# EAGLE design HB-UNI-SenAct-4-4-RC_V2.1 (EAGLE 9.3.1)
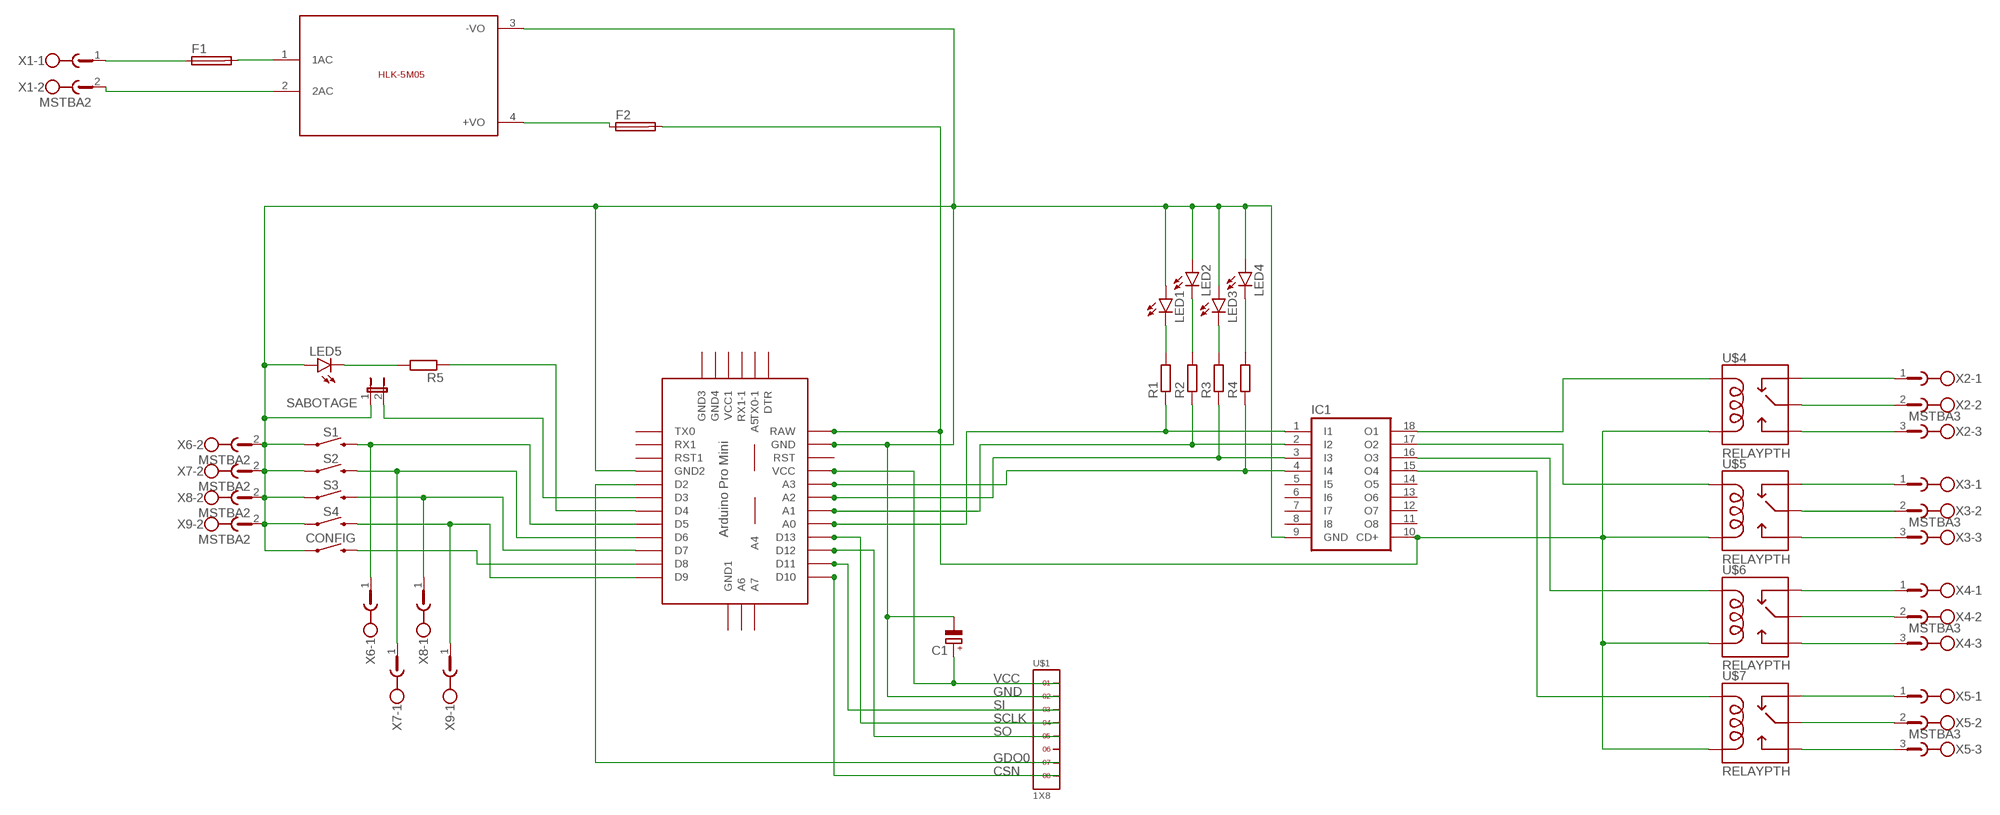
[diagram p0: schematic, sheet 1]

## Parts
C1  CPOL-EUE2.5-5  [E2,5-5]
CONFIG  MOMENTARY-SWITCH-SPST-PTH-6.0MM-KIT  [TACTILE_SWITCH_PTH_6.0MM_KIT]
F1  SH22,5A  [SH22,5A]
F2  SH22,5A  [SH22,5A]
IC1  ULN2803A  [DIL18]
LED1  LED3MM  [LED3MM]
LED2  LED3MM  [LED3MM]
LED3  LED3MM  [LED3MM]
LED4  LED3MM  [LED3MM]
LED5  LED3MM  [LED3MM]
R1  R-EU_0309/10  [0309/10]
R2  R-EU_0309/10  [0309/10]
R3  R-EU_0309/10  [0309/10]
R4  R-EU_0309/10  [0309/10]
R5  R-EU_0309/10  [0309/10]
S1  MOMENTARY-SWITCH-SPST-PTH-6.0MM  [TACTILE_SWITCH_PTH_6.0MM]
S2  MOMENTARY-SWITCH-SPST-PTH-6.0MM-KIT  [TACTILE_SWITCH_PTH_6.0MM_KIT]
S3  MOMENTARY-SWITCH-SPST-PTH-6.0MM-KIT  [TACTILE_SWITCH_PTH_6.0MM_KIT]
S4  MOMENTARY-SWITCH-SPST-PTH-6.0MM-KIT  [TACTILE_SWITCH_PTH_6.0MM_KIT]
SABOTAGE  JP1E  [JP1]
U$1  1X8  [1X8]
U$2  ABK-PRO-MINI  [ABK-PRO-MINI]
U$3  5VDC/5W  HLK-5M05  [HLK-5M05]
U$4  RELAYPTH  [SRD-05VDC-SL-C]
U$5  RELAYPTH  [SRD-05VDC-SL-C]
U$6  RELAYPTH  [SRD-05VDC-SL-C]
U$7  RELAYPTH  [SRD-05VDC-SL-C]
X1  MSTBA2  [MSTBA2]
X2  MSTBA3  [MSTBA3]
X3  MSTBA3  [MSTBA3]
X4  MSTBA3  [MSTBA3]
X5  MSTBA3  [MSTBA3]
X6  MSTBA2  [MSTBA2]
X7  MSTBA2  [MSTBA2]
X8  MSTBA2  [MSTBA2]
X9  MSTBA2  [MSTBA2]

## Nets
CSN: U$1.8 U$2.D10
GDO0: U$1.7 U$2.D2
GND: C1.- CONFIG.1 IC1.9(GND) LED1.A LED2.A LED3.A LED4.A LED5.A S1.1 S2.1 S3.1 S4.1 SABOTAGE.1 U$1.2 U$2.GND U$2.GND1(GND2) U$3.3(-VO) X6.2 X7.2 X8.2 X9.2
N$1: IC1.1(I1) R1.1 U$2.A0
N$2: IC1.2(I2) R2.1 U$2.A1
N$3: IC1.3(I3) R3.1 U$2.A2
N$4: IC1.4(I4) R4.1 U$2.A3
N$5: LED1.K(C) R1.2
N$6: LED2.K(C) R2.2
N$7: LED3.K(C) R3.2
N$8: LED4.K(C) R4.2
N$9: F1.1 X1.1
N$10: F2.1 U$3.4(+VO)
N$11: U$3.2(2AC) X1.2
N$12: S1.3 U$2.D5 X6.1
N$13: S2.3 U$2.D6 X7.1
N$14: S3.3 U$2.D7 X8.1
N$15: S4.3 U$2.D9 X9.1
N$16: CONFIG.3 U$2.D8
N$17: R5.1 U$2.D4
N$18: LED5.K(C) R5.2
N$19: F1.2 U$3.1(1AC)
N$20: SABOTAGE.2 U$2.D3
N$21: U$6.SWCLOSED(SWCLOSE) X4.1
N$22: U$7.SWCOMMON X5.2
N$23: U$6.SWOPEN X4.3
N$24: F2.2 IC1.10(CD+) U$2.RAW U$4.COIL0 U$5.COIL0 U$6.COIL0 U$7.COIL0
N$25: U$7.SWCLOSED(SWCLOSE) X5.1
N$26: U$6.SWCOMMON X4.2
N$27: U$7.SWOPEN X5.3
N$28: U$5.SWOPEN X3.3
N$29: U$5.SWCOMMON X3.2
N$30: U$5.SWCLOSED(SWCLOSE) X3.1
N$31: U$4.SWOPEN X2.3
N$32: U$4.SWCOMMON X2.2
N$33: U$4.SWCLOSED(SWCLOSE) X2.1
N$34: IC1.18(O1) U$4.COIL1
N$35: IC1.17(O2) U$5.COIL1
N$36: IC1.16(O3) U$6.COIL1
N$37: IC1.15(O4) U$7.COIL1
SCLK: U$1.4 U$2.D13
SI: U$1.3 U$2.D11
SO: U$1.5 U$2.D12
VCC: C1.+ U$1.1 U$2.VCC
Unconnected: IC1.5(I5) IC1.6(I6) IC1.7(I7) IC1.8(I8) IC1.11(O8) IC1.12(O7) IC1.13(O6) IC1.14(O5) U$1.6 U$2.A4 U$2.A5 U$2.A6 U$2.A7 U$2.DTR U$2.GND2(GND3) U$2.GND3(GND4) U$2.GND4(GND1) U$2.RST U$2.RST1 U$2.RX1 U$2.RX1-1 U$2.TX0 U$2.TX0-1 U$2.VCC1

## Library data of the parts
C1 = resistor:CPOL-EU: POLARIZED CAPACITOR, European symbol
CONFIG S1-S4 = SparkFun-Switches:MOMENTARY-SWITCH-SPST: Momentary Switch (Pushbutton) - SPST Normally-open (NO) SPST momentary switches (buttons, pushbuttons). Variants PTH-12MM - 12mm square, through-hole Momentary Pushbutton Switch - 12mm Square <https://www.sparkfun.com/products/9190> (COM-09190) PTH-6.0MM, PTH-6.0MM-KIT - 6.0mm square, through-hole Mini Pushbutton Switch <https://www.sparkfun.com/products/97> (COM-00097) KIT package intended for soldering kit's - only one side of pads' copper is exposed. PTH-RIGHT-ANGLE-KIT - Right-angle, through-hole Right Angle Tactile Button <https://www.sparkfun.com/products/10791> - Used on SparkFun BigTime Watch Kit <https://www.sparkfun.com/products/11734> SMD-12MM - 12mm square, surface-mount Tactile Button - SMD (12mm) <https://www.sparkfun.com/products/12993> (COM-12993) Used on SparkFun PicoBoard <https://www.sparkfun.com/products/11888> SMD-4.5MM - 4.5mm Square Trackball Switch Used on SparkFun Blackberry Trackballer Breakout <https://www.sparkfun.com/products/13169> SMD-4.6MMX2.8MM - 4.60mm x 2.80mm, surface mount Used on SparkFun SAMD21 Mini Breakout <https://www.sparkfun.com/products/13664> SMD-5.2MM, SMD-5.2-REDUNDANT - 5.2mm square, surface-mount Mini Pushbutton Switch - SMD <https://www.sparkfun.com/products/8720> (COM-08720) Used on Arduino Pro Mini <https://www.sparkfun.com/products/11114> REDUNDANT package connects both switch circuits together SMD-6.0X3.5MM - 6.0 x 3.5mm, surface mount Momentary Reset Switch SMD <https://www.sparkfun.com/products/8229> (COM-08229) SMD-6.2MM-TALL - 6.2mm square, surface mount Tactile Button - SMD (6mm) <https://www.sparkfun.com/products/12992> Used on SparkFun Digital Sandbox <https://www.sparkfun.com/products/12651> SMD-RIGHT-ANGLE - Right-angle, surface mount Used on SparkFun Block for Intel® Edison - Arduino <https://www.sparkfun.com/products/13036>; PROD_ID: SWCH-08441; SF_SKU: COM-00097
F1 F2 = fuse:SH22,5A: FUSE HOLDER grid 22,5mm, isolated cap OGN0031 8201, Schurter (Buerklin); MPN: 0031.7701.11; OC_FARNELL: unknown; OC_NEWARK: 04F1224
IC1 = uln-udn:ULN2803A: DRIVER ARRAY
LED1-LED5 = led:LED: LED OSRAM: - CHIPLED LG R971, LG N971, LY N971, LG Q971, LY Q971, LO R971, LY R971 LH N974, LH R974 LS Q976, LO Q976, LY Q976 LO Q996 - Hyper CHIPLED LW Q18S LB Q993, LB Q99A, LB R99A - SideLED LS A670, LO A670, LY A670, LG A670, LP A670 LB A673, LV A673, LT A673, LW A673 LH A674 LY A675 LS A676, LA A676, LO A676, LY A676, LW A676 LS A679, LY A679, LG A679 - Hyper Micro SIDELED® LS Y876, LA Y876, LO Y876, LY Y876 LT Y87S - SmartLED LW L88C, LW L88S LB L89C, LB L89S, LG L890 LS L89K, LO L89K, LY L89K LS L896, LA L896, LO L896, LY L896 - TOPLED LS T670, LO T670, LY T670, LG T670, LP T670 LSG T670, LSP T670, LSY T670, LOP T670, LYG T670 LG T671, LOG T671, LSG T671 LB T673, LV T673, LT T673, LW T673 LH T674 LS T676, LA T676, LO T676, LY T676, LB T676, LH T676, LSB T676, LW T676 LB T67C, LV T67C, LT T67C, LS T67K, LO T67K, LY T67K, LW E67C LS E67B, LA E67B, LO E67B, LY E67B, LB E67C, LV E67C, LT E67C LW T67C LS T679, LY T679, LG T679 LS T770, LO T770, LY T770, LG T770, LP T770 LB T773, LV T773, LT T773, LW T773 LH T774 LS E675, LA E675, LY E675, LS T675 LS T776, LA T776, LO T776, LY T776, LB T776 LHGB T686 LT T68C, LB T68C - Hyper Mini TOPLED® LB M676 - Mini TOPLED Santana® LG M470 LS M47K, LO M47K, LY M47K Source: http://www.osram.convergy.de LUXEON: - LUMILED® LXK2-PW12-R00, LXK2-PW12-S00, LXK2-PW14-U00, LXK2-PW14-V00 LXK2-PM12-R00, LXK2-PM12-S00, LXK2-PM14-U00 LXK2-PE12-Q00, LXK2-PE12-R00, LXK2-PE12-S00, LXK2-PE14-T00, LXK2-PE14-U00 LXK2-PB12-K00, LXK2-PB12-L00, LXK2-PB12-M00, LXK2-PB14-N00, LXK2-PB14-P00, LXK2-PB14-Q00 LXK2-PR12-L00, LXK2-PR12-M00, LXK2-PR14-Q00, LXK2-PR14-R00 LXK2-PD12-Q00, LXK2-PD12-R00, LXK2-PD12-S00 LXK2-PH12-R00, LXK2-PH12-S00 LXK2-PL12-P00, LXK2-PL12-Q00, LXK2-PL12-R00 Source: www.luxeon.com KINGBRIGHT: KA-3528ASYC Source: www.kingbright.com
R1-R5 = resistor:R-EU_: RESISTOR, European symbol
SABOTAGE = jumper:JP1E: JUMPER
U$1 = headers(2mm):1X8
U$2 = Arduino-clone:ABK-PRO-MINI: ABK Pro-Mini Arduino Clone
U$3 = HLK-5M05:HLK-5M05: HLK-5M05 is an 5Volt/5W smps developed by HI-LINK; SIZE: 23x38(mm)
U$4-U$7 = SRD-05VDC-SL-C:RELAY: SPDT relay (COM-00101)
X1 X6-X9 = con-phoenix-508:MSTBA2: PHOENIX; MF: FARNELL; MPN: 1757242; OC_FARNELL: 3705171; OC_NEWARK: 71C4161
X2-X5 = con-phoenix-508:MSTBA3: PHOENIX; MF: FARNELL; MPN: 1757255; OC_FARNELL: 3705183; OC_NEWARK: 71C4162

## Board
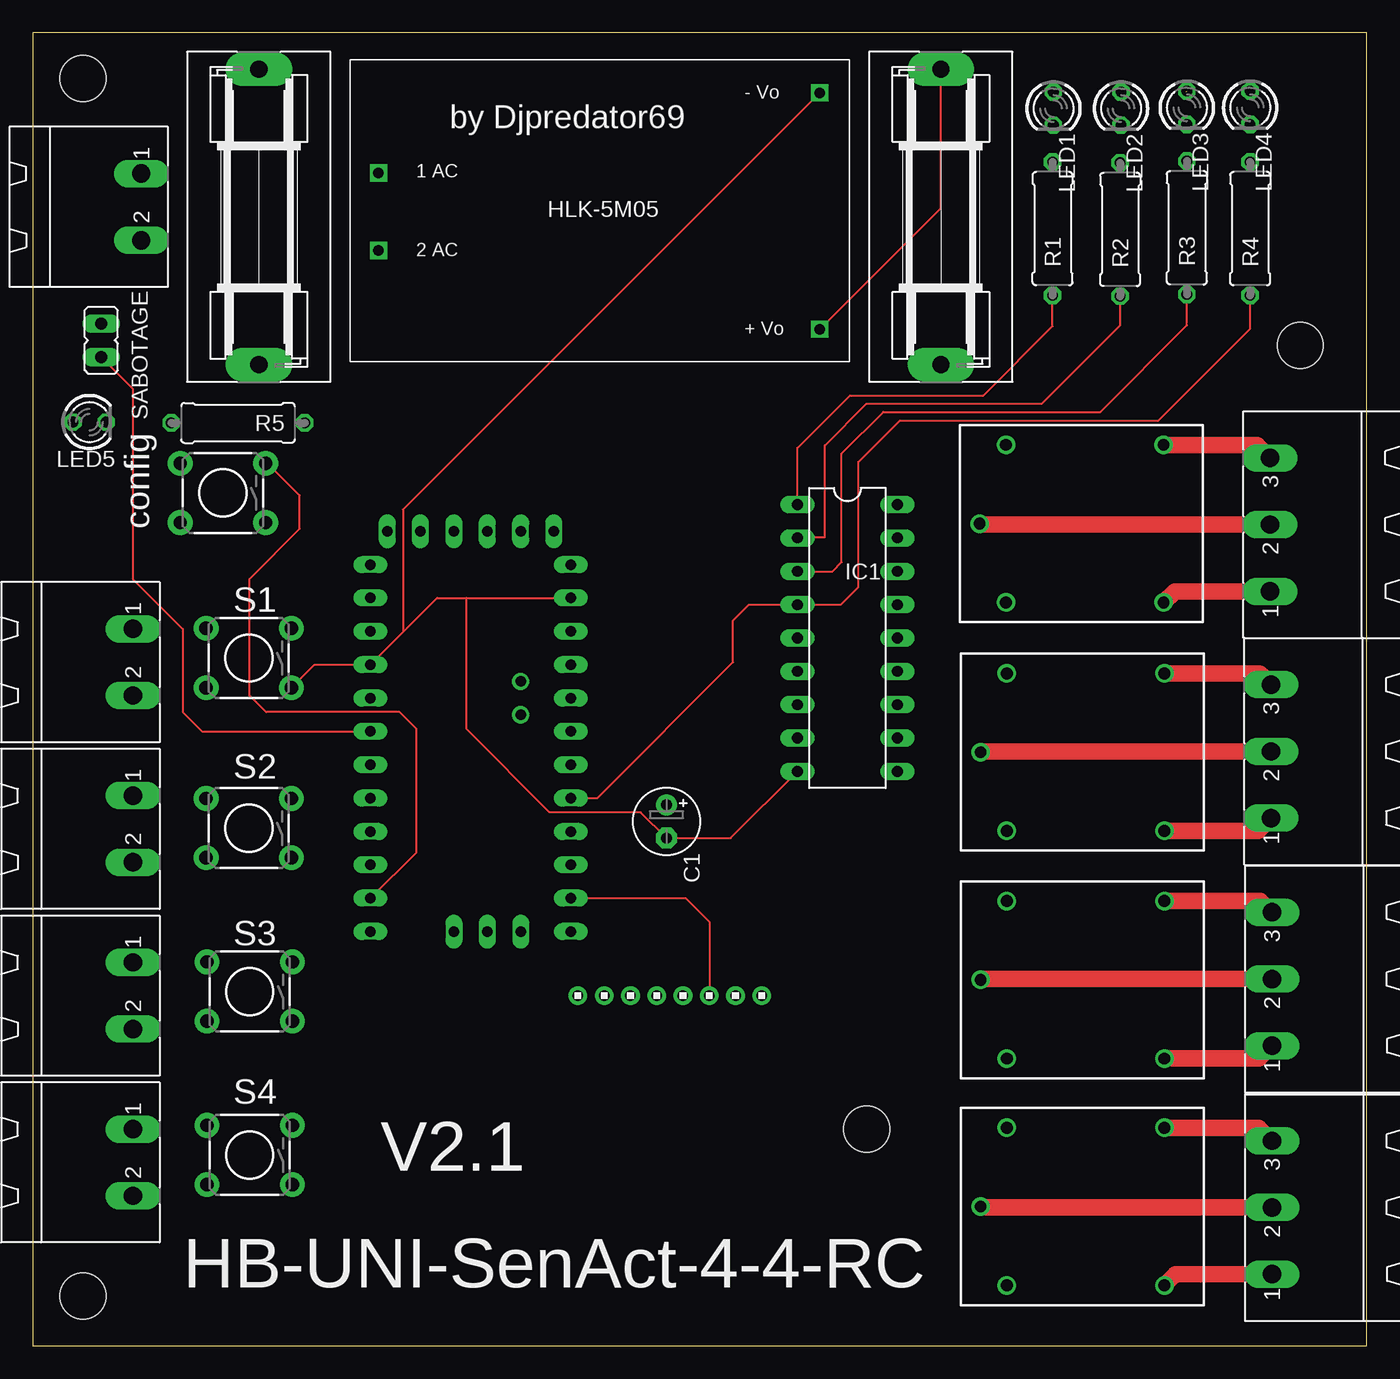
[diagram p1: board, top side]
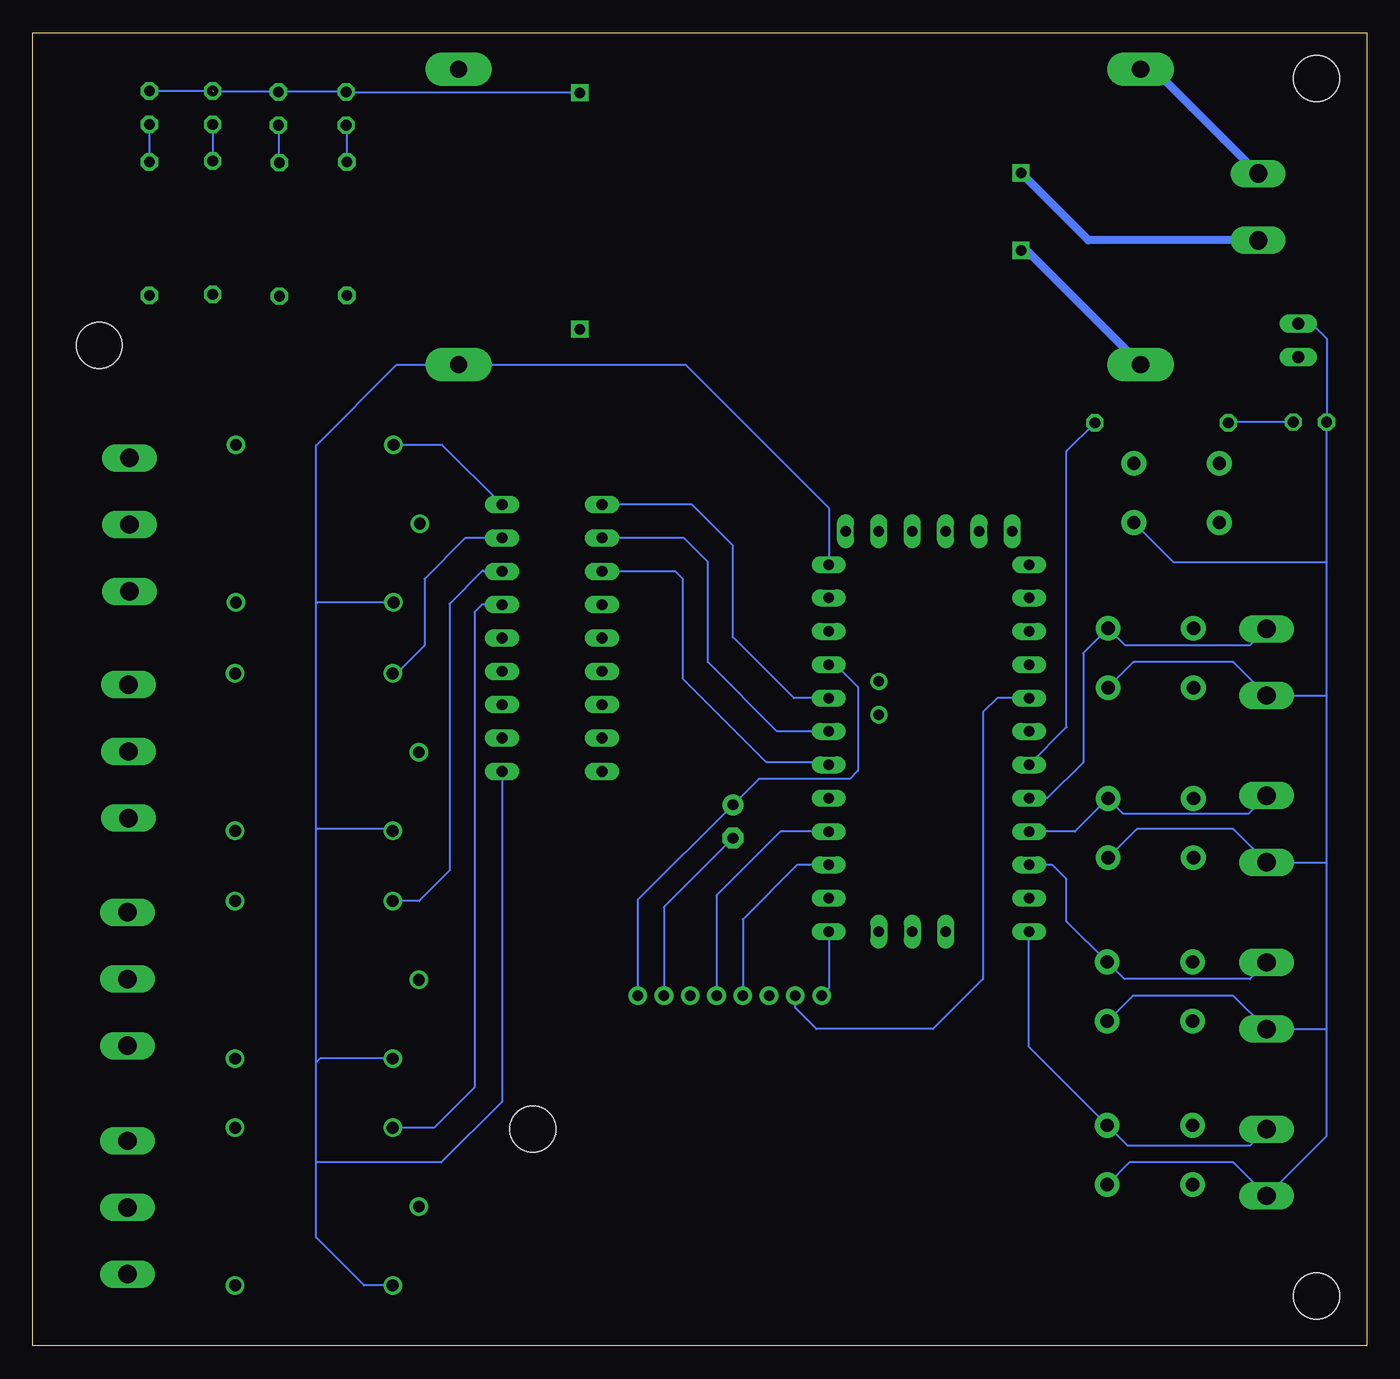
[diagram p2: board, bottom side, seen from below]

Size 101.58 x 100 mm. Coordinates in mm from the lower left corner, seen from the top.
Outline: 0,0 101.58,0 101.58,100 0,100 0,0
Copper layers (1*16): Top 0.035mm / dielectric 1.5mm / Bottom 0.035mm
Design rules "default": minimum track width 6mil, minimum drill 0.35mm, track to track 6mil, track to pad 6mil, pad to pad 6mil, via to via 6mil, smd to smd 6mil, copper to edge 40mil, drill to drill 6mil, minimum pad ring 10mil, minimum via ring 8mil, stop-mask expansion 4mil, vias tented up to drill 0mil, thermal gap 10mil
Holes 3.5 mm at 3.81,96.52 96.52,76.2 63.5,16.51 3.81,3.81

### Footprints (pad centres in the part's own frame; a part is rotated, then mirrored left to right if it is on the bottom)
E2,5-5 = drill 0.813 pad 1.6: + -1.27,0 | drill 0.813 pad 1.6 octagon: - 1.27,0
TACTILE_SWITCH_PTH_6.0MM_KIT = drill 1.016 pad 1.88: 1 -3.251,2.261; 2 3.251,2.261; 3 -3.251,-2.261; 4 3.251,-2.261
SH22,5A = drill 1.321 pad 2.54 long: 1 -11.252,0; 2 11.252,0
DIL18 = drill 0.813 long: 1 -10.16,-3.81; 2 -7.62,-3.81; 3 -5.08,-3.81; 4 -2.54,-3.81; 5 0,-3.81; 6 2.54,-3.81; 7 5.08,-3.81; 8 7.62,-3.81; 9 10.16,-3.81; 10 10.16,3.81; 11 7.62,3.81; 12 5.08,3.81; 13 2.54,3.81; 14 0,3.81; 15 -2.54,3.81; 16 -5.08,3.81; 17 -7.62,3.81; 18 -10.16,3.81
LED3MM = drill 0.813 octagon: A -1.27,0; K 1.27,0
0309/10 = drill 0.813 octagon: 1 -5.08,0; 2 5.08,0
TACTILE_SWITCH_PTH_6.0MM = drill 1.016 pad 1.88: 1 -3.251,2.261; 2 3.251,2.261; 3 -3.251,-2.261; 4 3.251,-2.261
JP1 = drill 0.914 long: 1 0,-1.27; 2 0,1.27
1X8 = drill 0.8 pad 1.422: 1 -7,0; 2 -5,0; 3 -3,0; 4 -1,0; 5 1,0; 6 3,0; 7 5,0; 8 7,0
ABK-PRO-MINI = drill 0.8 long: A0 10.16,-3.81; A1 10.16,-6.35; A2 10.16,-8.89; A3 10.16,-11.43; A6 3.81,-21.59; A7 6.35,-21.59; D2 -5.08,-3.81; D3 -5.08,-6.35; D4 -5.08,-8.89; D5 -5.08,-11.43; D6 -5.08,-13.97; D7 -5.08,-16.51; D8 -5.08,-19.05; D9 -5.08,-21.59; D10 10.16,-21.59; D11 10.16,-19.05; D12 10.16,-16.51; D13 10.16,-13.97; DTR 8.89,8.89; GND 10.16,3.81; GND1 -5.08,-1.27; GND2 -3.81,8.89; GND3 -1.27,8.89; GND4 1.27,-21.59; RAW 10.16,6.35; RST 10.16,1.27; RST1 -5.08,1.27; RX1 -5.08,3.81; RX1-1 3.81,8.89; TX0 -5.08,6.35; TX0-1 6.35,8.89; VCC 10.16,-1.27; VCC1 1.27,8.89 | drill 0.8: A4 6.35,-5.08; A5 6.35,-2.54
HLK-5M05 = drill 0.8 square: 1 -16.85,-2.93; 2 -16.85,2.97; 3 16.75,9.07; 4 16.75,-8.93
SRD-05VDC-SL-C = drill 0.9: COIL0 -5.39,-6.12; COIL1 -5.39,5.88; SWCLOSED 6.61,-6.12; SWCOMMON -7.39,-0.12; SWOPEN 6.61,5.88
MSTBA2 = drill 1.397 long: 1 -2.54,5.08; 2 2.54,5.08
MSTBA3 = drill 1.397 long: 1 -5.08,5.08; 2 0,5.08; 3 5.08,5.08

### Placement (x,y rotation side)
C1  48.26,39.94 270 top
CONFIG  14.48,64.96 180 top
F1  17.21,85.98 270 top
F2  69.15,85.98 270 top
IC1  62.04,53.91 270 top
LED1  77.72,94.23 270 top
LED2  82.87,94.23 270 top
LED3  87.88,94.3 270 top
LED4  92.71,94.3 270 top
LED5  4.32,70.36 0 top
R1  77.66,85.09 90 top
R2  82.8,85.03 90 top
R3  87.88,85.15 90 top
R4  92.71,85.09 90 top
R5  15.62,70.29 180 top
S1  16.45,52.39 180 top
S2  16.45,39.43 180 top
S3  16.51,26.99 180 top
S4  16.51,14.54 180 top
SABOTAGE  5.21,76.58 180 top
U$1  48.51,26.67 180 top
U$2  30.8,53.15 0 top
U$3  43.18,86.36 0 top
U$4  79.5,62.74 0 top
U$5  79.57,45.34 0 top
U$6  79.57,28 0 top
U$7  79.57,10.73 0 top
X1  3.17,86.74 270 top
X2  99.31,62.55 90 top
X3  99.38,45.28 90 top
X4  99.44,27.94 90 top
X5  99.44,10.54 90 top
X6  2.54,52.07 270 top
X7  2.54,39.37 270 top
X8  2.54,26.67 270 top
X9  2.54,13.97 270 top

### Tracks (layer width: path | path; a pad name or v marks a point on that pad's centre or on a via)
CSN
  Bottom 0.152: U$2.D10 40.96,27.23 U$1.8
GDO0
  Bottom 0.152: U$2.D2 28.13,49.34 29.21,48.26 29.21,27.94 33.02,24.13 41.91,24.13 43.51,25.73 U$1.7
GND  (1 unrouted)
  Top 0.152: S1.1 21.45,51.88 U$2.GND1 28.19,54.36 | 33.02,56.96 30.8,56.96 28.19,54.36 | 33.02,56.96 U$2.GND | U$3.3 28.19,63.69 28.19,54.36 | 33.02,56.96 33.02,46.99 39.37,40.64 46.29,40.64 C1.- 53.15,38.67 IC1.9
  Bottom 0.152: C1.- 53.51,33.42 U$1.2 | S4.1 18.07,13.97 10.16,13.97 X9.2 3.05,16 3.05,24.13 | S3.1 17.82,26.67 10.16,26.67 X8.2 3.05,24.13 | S2.1 17.5,39.37 10.16,39.37 X7.2 3.05,36.83 | S1.1 17.75,52.07 10.16,52.07 X6.2 3.05,49.53 | 3.05,24.13 3.05,36.83 | 3.05,36.83 3.05,49.53 | 3.05,49.53 3.05,59.69 | 3.05,59.69 LED5.A 3.05,76.71 4.19,77.85 SABOTAGE.1 | CONFIG.1 14.72,59.69 3.05,59.69 | U$3.3 77.65,95.43 LED1.A LED2.A 87.82,95.5 | LED3.A LED4.A
N$1
  Top 0.152: IC1.1 58.23,68.39 62.23,72.39 72.39,72.39 77.66,77.66 R1.1
  Bottom 0.152: U$2.A0 43.62,49.34 48.26,53.98 48.26,60.96 51.37,64.07 IC1.1
N$2
  Top 0.152: IC1.2 58.29,61.59 60.33,61.59 60.33,68.58 63.5,71.75 76.83,71.75 82.8,77.72 R2.1
  Bottom 0.152: U$2.A1 44.9,46.8 50.16,52.07 50.16,59.69 52.01,61.53 IC1.2
N$3
  Top 0.152: IC1.3 60.9,58.99 61.59,59.69 61.59,67.94 64.77,71.12 81.28,71.12 87.88,77.72 R3.1
  Bottom 0.152: U$2.A2 41.15,44.45 45.72,44.45 52.07,50.8 52.07,58.42 52.64,58.99 IC1.3
N$4
  Top 0.152: U$2.A3 42.99,41.72 53.34,52.07 53.34,55.24 54.55,56.45 IC1.4 61.53,56.45 62.87,57.78 62.87,67.31 66.04,70.48 85.72,70.48 92.71,77.47 R4.1
N$5
  Bottom 0.152: R1.2 77.66,92.9 LED1.K
N$6
  Bottom 0.152: LED2.K 82.87,90.17 R2.2
N$7
  Bottom 0.152: LED3.K R3.2
N$8
  Bottom 0.152: LED4.K R4.2
N$9
  Bottom 0.61: X1.1 16.2,97.23 F1.1
N$10
  Top 0.152: U$3.4 69.15,86.65 F2.1
N$11
  Bottom 0.61: X1.2 21.2,84.2 U$3.2
N$12
  Bottom 0.152: X6.1 8.89,53.34 18.39,53.34 S1.3 21.59,52.76 21.59,44.45 24.32,41.72 U$2.D5
N$13
  Bottom 0.152: X7.1 9,40.53 18.53,40.53 S2.3 22.21,39.18 U$2.D6
N$14
  Bottom 0.152: X8.1 8.89,27.94 18.45,27.94 S3.3 22.86,32.35 22.86,35.56 23.94,36.64 U$2.D7
N$15
  Bottom 0.152: X9.1 8.89,15.24 18.2,15.24 S4.3 25.72,22.76 U$2.D9
N$16
  Top 0.152: U$2.D8 29.21,37.59 29.21,46.99 27.94,48.26 17.78,48.26 16.51,49.53 16.51,58.42 20.32,62.23 20.32,64.77 17.78,67.31 17.73,67.26 CONFIG.3
N$17
  Bottom 0.152: U$2.D4 22.86,47.12 22.86,68.14 R5.1
N$18
  Bottom 0.152: LED5.K 10.48,70.36 R5.2
N$19
  Bottom 0.61: F1.2 25.91,83.43 U$3.1
N$20
  Top 0.152: SABOTAGE.2 7.62,72.9 7.62,58.42 11.43,54.61 11.43,48.26 12.89,46.8 U$2.D3
N$21
  Top 1.27: U$6.SWCLOSED 93.39,21.88 X4.1
N$22
  Top 1.27: X5.2 72.25,10.54 U$7.SWCOMMON
N$23
  Top 1.27: U$6.SWOPEN 93.5,33.88 X4.3
N$24
  Bottom 0.152: U$2.RAW 40.96,63.82 51.87,74.73 F2.2 73.86,74.73 80.01,68.58 80.01,56.52 | U$7.COIL0 76.37,4.61 80.01,8.26 80.01,13.97 | 80.01,13.97 80.01,21.59 | 80.01,21.59 80.01,39.37 | 80.01,39.37 80.01,56.52 | U$6.COIL0 79.72,21.88 80.01,21.59 | U$5.COIL0 74.33,39.37 80.01,39.37 | U$4.COIL0 79.91,56.62 80.01,56.52 | IC1.10 65.85,18.61 70.48,13.97 80.01,13.97
N$25
  Top 1.27: U$7.SWCLOSED 87.03,5.46 X5.1
N$26
  Top 1.27: X4.2 72.23,27.94 U$6.SWCOMMON
N$27
  Top 1.27: U$7.SWOPEN 93.37,16.61 X5.3
N$28
  Top 1.27: U$5.SWOPEN 93.43,51.22 X3.3
N$29
  Top 1.27: X3.2 72.23,45.28 U$5.SWCOMMON
N$30
  Top 1.27: U$5.SWCLOSED 93.32,39.22 X3.1
N$31
  Top 1.27: U$4.SWOPEN 93.24,68.62 X2.3
N$32
  Top 1.27: X2.2 72.18,62.55 U$4.SWCOMMON
N$33
  Top 1.27: U$4.SWCLOSED 86.96,57.47 X2.1
N$34
  Bottom 0.152: IC1.18 70.4,68.62 U$4.COIL1
N$35
  Bottom 0.152: IC1.17 68.64,61.53 71.75,58.42 71.75,53.34 73.88,51.22 U$5.COIL1
N$36
  Bottom 0.152: IC1.16 67.25,58.99 67.31,59.05 69.85,56.52 69.85,36.2 72.16,33.88 U$6.COIL1
N$37
  Bottom 0.152: IC1.15 67.37,56.45 67.94,55.88 67.94,19.68 71.02,16.61 U$7.COIL1
SCLK
  Bottom 0.152: U$2.D13 44.64,39.18 49.53,34.29 49.53,26.69 U$1.4
SI
  Top 0.152: U$2.D11 49.72,34.1 51.51,32.31 U$1.3
SO
  Bottom 0.152: U$2.D12 43.37,36.64 47.51,32.5 U$1.5
VCC
  Bottom 0.152: U$1.1 55.51,33.96 C1.+ 46.29,43.18 39.37,43.18 38.73,43.81 38.73,50.16 40.45,51.88 U$2.VCC

### Text on the board
tNames: by Djpredator69 | config | S1 | S2 | S3 | S4 | V2.1 | HB-UNI-SenAct-4-4-RC